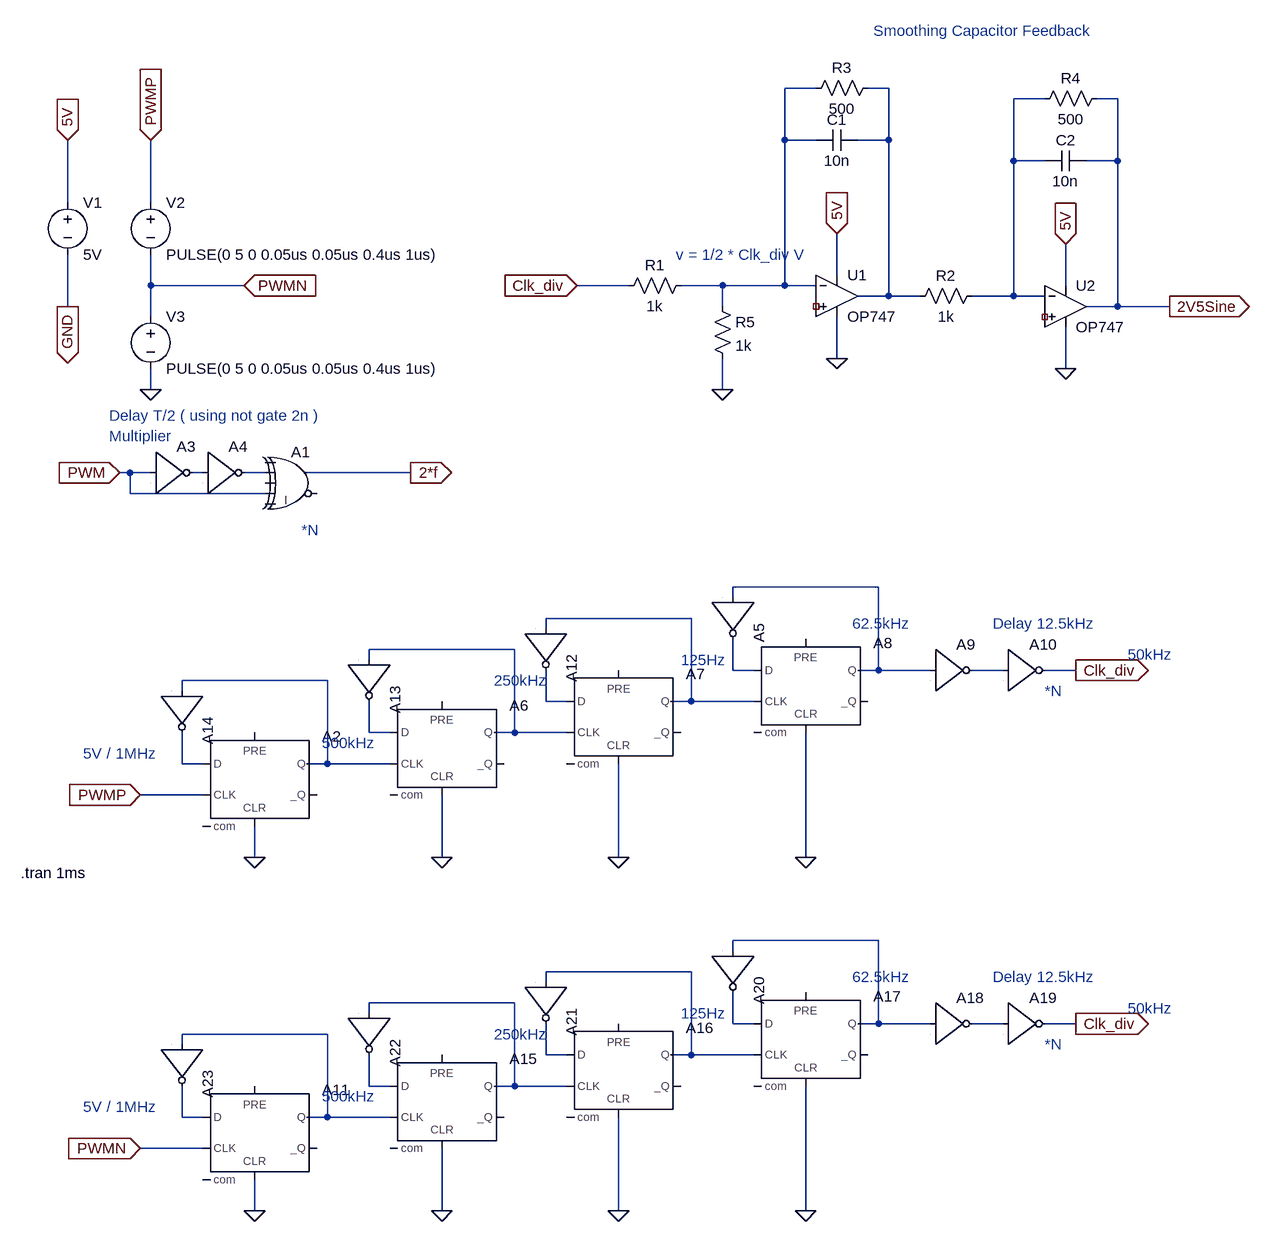
[diagram p0: schematic Clock Div Mult to Sine_files.asc]
Clock Div Mult to Sine_files.asc, the LTspice schematic file:
Version 4
SHEET 1 1912 1700
WIRE 1216 -48 1168 -48
WIRE 1328 -48 1296 -48
WIRE 1568 -32 1520 -32
WIRE 1680 -32 1648 -32
WIRE 1168 32 1168 -48
WIRE 1216 32 1168 32
WIRE 1328 32 1328 -48
WIRE 1328 32 1280 32
WIRE 1520 64 1520 -32
WIRE 1568 64 1520 64
WIRE 1680 64 1680 -32
WIRE 1680 64 1632 64
WIRE 64 128 64 32
WIRE 192 128 192 32
WIRE 1248 240 1248 176
WIRE 192 256 192 208
WIRE 336 256 192 256
WIRE 928 256 848 256
WIRE 1072 256 1008 256
WIRE 1168 256 1168 32
WIRE 1168 256 1072 256
WIRE 1216 256 1168 256
WIRE 1600 256 1600 192
WIRE 1328 272 1328 32
WIRE 1328 272 1280 272
WIRE 1376 272 1328 272
WIRE 1520 272 1520 64
WIRE 1520 272 1456 272
WIRE 1568 272 1520 272
WIRE 64 288 64 208
WIRE 1072 288 1072 256
WIRE 1680 288 1680 64
WIRE 1680 288 1632 288
WIRE 1760 288 1680 288
WIRE 192 304 192 256
WIRE 1248 368 1248 304
WIRE 1600 384 1600 320
WIRE 192 416 192 384
WIRE 1072 416 1072 368
WIRE 160 544 144 544
WIRE 192 544 160 544
WIRE 272 544 256 544
WIRE 368 544 336 544
WIRE 592 544 432 544
WIRE 160 576 160 544
WIRE 368 576 160 576
WIRE 1312 720 1088 720
WIRE 1088 736 1088 720
WIRE 1024 768 800 768
WIRE 800 784 800 768
WIRE 752 816 528 816
WIRE 528 832 528 816
WIRE 1088 848 1088 800
WIRE 1120 848 1088 848
WIRE 1312 848 1312 720
WIRE 1312 848 1280 848
WIRE 1392 848 1312 848
WIRE 1504 848 1456 848
WIRE 1616 848 1568 848
WIRE 464 864 240 864
WIRE 240 880 240 864
WIRE 800 896 800 848
WIRE 832 896 800 896
WIRE 1024 896 1024 768
WIRE 1024 896 992 896
WIRE 1120 896 1024 896
WIRE 528 944 528 896
WIRE 560 944 528 944
WIRE 752 944 752 816
WIRE 752 944 720 944
WIRE 832 944 752 944
WIRE 240 992 240 944
WIRE 272 992 240 992
WIRE 464 992 464 864
WIRE 464 992 432 992
WIRE 560 992 464 992
WIRE 272 1040 176 1040
WIRE 352 1136 352 1088
WIRE 640 1136 640 1040
WIRE 912 1136 912 992
WIRE 1200 1136 1200 944
WIRE 1312 1264 1088 1264
WIRE 1088 1280 1088 1264
WIRE 1024 1312 800 1312
WIRE 800 1328 800 1312
WIRE 752 1360 528 1360
WIRE 528 1376 528 1360
WIRE 1088 1392 1088 1344
WIRE 1120 1392 1088 1392
WIRE 1312 1392 1312 1264
WIRE 1312 1392 1280 1392
WIRE 1392 1392 1312 1392
WIRE 1504 1392 1456 1392
WIRE 1616 1392 1568 1392
WIRE 464 1408 240 1408
WIRE 240 1424 240 1408
WIRE 800 1440 800 1392
WIRE 832 1440 800 1440
WIRE 1024 1440 1024 1312
WIRE 1024 1440 992 1440
WIRE 1120 1440 1024 1440
WIRE 528 1488 528 1440
WIRE 560 1488 528 1488
WIRE 752 1488 752 1360
WIRE 752 1488 720 1488
WIRE 832 1488 752 1488
WIRE 240 1536 240 1488
WIRE 272 1536 240 1536
WIRE 464 1536 464 1408
WIRE 464 1536 432 1536
WIRE 560 1536 464 1536
WIRE 272 1584 176 1584
WIRE 352 1680 352 1632
WIRE 640 1680 640 1584
WIRE 912 1680 912 1536
WIRE 1200 1680 1200 1488
FLAG 64 32 5V
IOPIN 64 32 In
FLAG 192 32 PWMP
IOPIN 192 32 In
FLAG 64 288 GND
IOPIN 64 288 Out
FLAG 144 544 PWM
IOPIN 144 544 In
FLAG 592 544 2*f
IOPIN 592 544 Out
FLAG 176 1040 PWMP
IOPIN 176 1040 In
FLAG 1616 848 Clk_div
IOPIN 1616 848 Out
FLAG 352 1136 0
FLAG 640 1136 0
FLAG 912 1136 0
FLAG 1200 1136 0
FLAG 848 256 Clk_div
IOPIN 848 256 In
FLAG 1248 176 5V
IOPIN 1248 176 In
FLAG 1248 368 0
FLAG 1600 192 5V
IOPIN 1600 192 In
FLAG 1600 384 0
FLAG 1760 288 2V5Sine
IOPIN 1760 288 Out
FLAG 192 416 0
FLAG 336 256 PWMN
IOPIN 336 256 In
FLAG 176 1584 PWMN
IOPIN 176 1584 In
FLAG 1616 1392 Clk_div
IOPIN 1616 1392 Out
FLAG 352 1680 0
FLAG 640 1680 0
FLAG 912 1680 0
FLAG 1200 1680 0
FLAG 1072 416 0
SYMBOL voltage 64 112 R0
SYMATTR InstName V1
SYMATTR Value 5V
SYMBOL voltage 192 112 R0
WINDOW 123 0 0 Left 0
WINDOW 39 0 0 Left 0
SYMATTR InstName V2
SYMATTR Value PULSE(0 5 0 0.05us 0.05us 0.4us 1us)
SYMBOL Digital\\xor 416 496 R0
SYMATTR InstName A1
SYMBOL Digital\\inv 192 480 R0
SYMATTR InstName A3
SYMBOL Digital\\inv 272 480 R0
SYMATTR InstName A4
SYMBOL Digital\\dflop 352 944 R0
SYMATTR InstName A2
SYMBOL Digital\\dflop 640 896 R0
SYMATTR InstName A6
SYMBOL Digital\\dflop 912 848 R0
SYMATTR InstName A7
SYMBOL Digital\\dflop 1200 800 R0
SYMATTR InstName A8
SYMBOL Digital\\inv 1392 784 R0
SYMATTR InstName A9
SYMBOL Digital\\inv 1504 784 R0
SYMATTR InstName A10
SYMBOL Digital\\inv 1152 736 R90
SYMATTR InstName A5
SYMBOL Digital\\inv 864 784 R90
SYMATTR InstName A12
SYMBOL Digital\\inv 592 832 R90
SYMATTR InstName A13
SYMBOL Digital\\inv 304 880 R90
SYMATTR InstName A14
SYMBOL res 1024 240 R90
WINDOW 0 0 56 VBottom 2
WINDOW 3 32 56 VTop 2
SYMATTR InstName R1
SYMATTR Value 1k
SYMBOL OpAmps\\OP747 1248 208 R0
SYMATTR InstName U1
SYMBOL res 1472 256 R90
WINDOW 0 0 56 VBottom 2
WINDOW 3 32 56 VTop 2
SYMATTR InstName R2
SYMATTR Value 1k
SYMBOL OpAmps\\OP747 1600 224 R0
SYMATTR InstName U2
SYMBOL cap 1280 16 R90
WINDOW 0 0 32 VBottom 2
WINDOW 3 32 32 VTop 2
SYMATTR InstName C1
SYMATTR Value 10n
SYMBOL cap 1632 48 R90
WINDOW 0 0 32 VBottom 2
WINDOW 3 32 32 VTop 2
SYMATTR InstName C2
SYMATTR Value 10n
SYMBOL res 1312 -64 R90
WINDOW 0 0 56 VBottom 2
WINDOW 3 32 56 VTop 2
SYMATTR InstName R3
SYMATTR Value 500
SYMBOL res 1664 -48 R90
WINDOW 0 0 56 VBottom 2
WINDOW 3 32 56 VTop 2
SYMATTR InstName R4
SYMATTR Value 500
SYMBOL voltage 192 288 R0
WINDOW 123 0 0 Left 0
WINDOW 39 0 0 Left 0
SYMATTR InstName V3
SYMATTR Value PULSE(0 5 0 0.05us 0.05us 0.4us 1us)
SYMBOL Digital\\dflop 352 1488 R0
SYMATTR InstName A11
SYMBOL Digital\\dflop 640 1440 R0
SYMATTR InstName A15
SYMBOL Digital\\dflop 912 1392 R0
SYMATTR InstName A16
SYMBOL Digital\\dflop 1200 1344 R0
SYMATTR InstName A17
SYMBOL Digital\\inv 1392 1328 R0
SYMATTR InstName A18
SYMBOL Digital\\inv 1504 1328 R0
SYMATTR InstName A19
SYMBOL Digital\\inv 1152 1280 R90
SYMATTR InstName A20
SYMBOL Digital\\inv 864 1328 R90
SYMATTR InstName A21
SYMBOL Digital\\inv 592 1376 R90
SYMATTR InstName A22
SYMBOL Digital\\inv 304 1424 R90
SYMATTR InstName A23
SYMBOL res 1056 272 R0
SYMATTR InstName R5
SYMATTR Value 1k
TEXT 128 456 Left 2 ;Delay T/2 ( using not gate 2n )\nMultiplier
TEXT 1488 776 Left 2 ;Delay 12.5kHz
TEXT 1568 880 Left 2 ;*N
TEXT 88 976 Left 2 ;5V / 1MHz
TEXT 456 960 Left 2 ;500kHz
TEXT 720 864 Left 2 ;250kHz
TEXT 1008 832 Left 2 ;125Hz
TEXT 1272 776 Left 2 ;62.5kHz
TEXT 1696 824 Left 2 ;50kHz
TEXT -8 1160 Left 2 !.tran 1ms
TEXT 424 632 Left 2 ;*N
TEXT 1304 -136 Left 2 ;Smoothing Capacitor Feedback
TEXT 1488 1320 Left 2 ;Delay 12.5kHz
TEXT 1568 1424 Left 2 ;*N
TEXT 88 1520 Left 2 ;5V / 1MHz
TEXT 456 1504 Left 2 ;500kHz
TEXT 720 1408 Left 2 ;250kHz
TEXT 1008 1376 Left 2 ;125Hz
TEXT 1272 1320 Left 2 ;62.5kHz
TEXT 1696 1368 Left 2 ;50kHz
TEXT 1000 208 Left 2 ;v = 1/2 * Clk_div V

The netlist it stands for:
* Clock Div Mult to Sine_files.asc
V1 5V GND 5V
V2 PWMP PWMN PULSE(0 5 0 0.05us 0.05us 0.4us 1us)
A1 0 N005 0 PWM 0 0 2*f 0 XOR
A3 PWM 0 0 0 0 N004 0 0 BUF
A4 N004 0 0 0 0 N005 0 0 BUF
A2 N014 0 PWMP 0 0 0 N011 0 DFLOP
A6 N013 0 N011 0 0 0 N008 0 DFLOP
A7 N012 0 N008 0 0 0 N007 0 DFLOP
A8 N009 0 N007 0 0 0 N006 0 DFLOP
A9 N006 0 0 0 0 N010 0 0 BUF
A10 N010 0 0 0 0 Clk_div 0 0 BUF
A5 N006 0 0 0 0 N009 0 0 BUF
A12 N007 0 0 0 0 N012 0 0 BUF
A13 N008 0 0 0 0 N013 0 0 BUF
A14 N011 0 0 0 0 N014 0 0 BUF
R1 N001 Clk_div 1k
XU1 NC_01 N001 5V 0 N002 OP747  ; pins In+ In- V+ V- OUT
R2 N003 N002 1k
XU2 NC_02 N003 5V 0 2V5Sine OP747  ; pins In+ In- V+ V- OUT
C1 N002 N001 10n
C2 2V5Sine N003 10n
R3 N002 N001 500
R4 2V5Sine N003 500
V3 PWMN 0 PULSE(0 5 0 0.05us 0.05us 0.4us 1us)
A11 N023 0 PWMN 0 0 0 N020 0 DFLOP
A15 N022 0 N020 0 0 0 N017 0 DFLOP
A16 N021 0 N017 0 0 0 N016 0 DFLOP
A17 N018 0 N016 0 0 0 N015 0 DFLOP
A18 N015 0 0 0 0 N019 0 0 BUF
A19 N019 0 0 0 0 Clk_div 0 0 BUF
A20 N015 0 0 0 0 N018 0 0 BUF
A21 N016 0 0 0 0 N021 0 0 BUF
A22 N017 0 0 0 0 N022 0 0 BUF
A23 N020 0 0 0 0 N023 0 0 BUF
R5 N001 0 1k
* Delay T/2 ( using not gate 2n )
* Multiplier
* Delay 12.5kHz
* *N
* 5V / 1MHz
* 500kHz
* 250kHz
* 125Hz
* 62.5kHz
* 50kHz
.tran 1ms
* *N
* Smoothing Capacitor Feedback
* Delay 12.5kHz
* *N
* 5V / 1MHz
* 500kHz
* 250kHz
* 125Hz
* 62.5kHz
* 50kHz
* v = 1/2 * Clk_div V
.backanno
.end